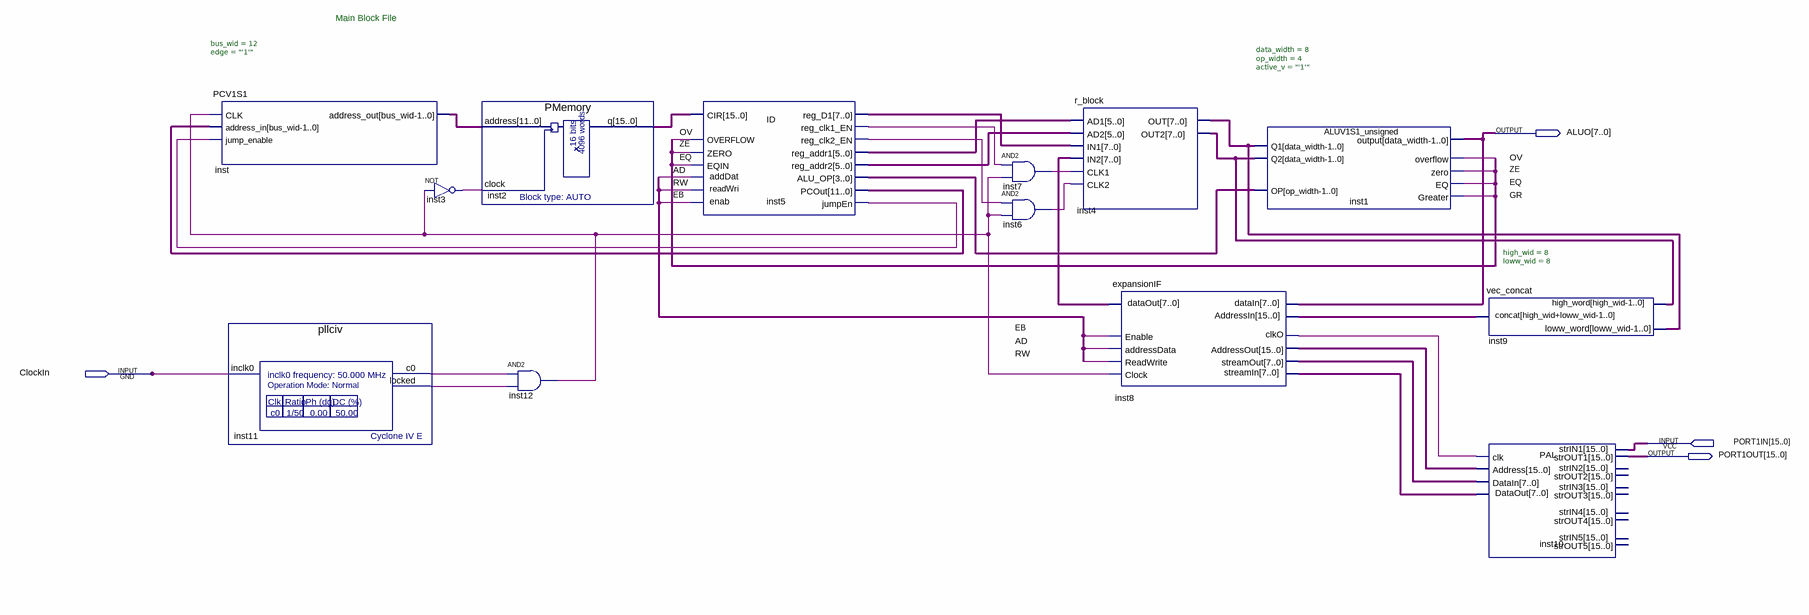
[diagram p0: schematic sheet]
// Quartus schematic SANDBOX.bdf as structural Verilog: 13 symbols, 4 pins
module SANDBOX (
  input  ClockIn,
  input  [15:0] PORT1IN,
  output [7:0] ALUO,
  output [15:0] PORT1OUT
);

  wire AD, EB, EQ, GR, inst3_out, inst5_jumpen, inst5_reg_clk1_en, inst5_reg_clk2_en, inst6_out, inst7_out,
       inst8_clko, inst11_c0, inst11_locked, inst12_out, OV, RW, ZE;
  wire [3:0] inst5_alu_op;
  wire [5:0] inst5_reg_addr1, inst5_reg_addr2;
  wire [7:0] inst4_out, inst4_out2, inst5_reg_d1, inst8_dataout, inst8_streamout, inst10_dataout;
  wire [11:0] inst5_pcout, inst_address_out;
  wire [15:0] inst2_q, inst8_addressout, inst9_concat;

  PCV1S1 #(.bus_wid(12), .\edge ("'1'")) inst (
    .CLK(inst12_out), .address_in(inst5_pcout), .jump_enable(inst5_jumpen), .address_out(inst_address_out));
  pllciv inst11 (.inclk0(ClockIn), .c0(inst11_c0), .locked(inst11_locked));
  not inst3 (inst3_out, inst12_out);
  PMemory inst2 (.address(inst_address_out), .clock(inst3_out), .q(inst2_q));
  and inst12 (inst12_out, inst11_c0, inst11_locked);
  ID inst5 (
    .CIR(inst2_q), .OVERFLOW(OV), .ZERO(ZE), .EQIN(EQ), .reg_D1(inst5_reg_d1),
    .reg_clk1_EN(inst5_reg_clk1_en), .reg_clk2_EN(inst5_reg_clk2_en), .reg_addr1(inst5_reg_addr1),
    .reg_addr2(inst5_reg_addr2), .ALU_OP(inst5_alu_op), .PCOut(inst5_pcout), .addDat(AD), .readWri(RW),
    .enab(EB), .jumpEn(inst5_jumpen));
  and inst7 (inst7_out, inst5_reg_clk1_en, inst12_out);
  and inst6 (inst6_out, inst5_reg_clk2_en, inst12_out);
  r_block inst4 (
    .AD1(inst5_reg_addr1), .AD2(inst5_reg_addr2), .IN1(inst5_reg_d1), .IN2(inst8_dataout), .CLK1(inst7_out),
    .CLK2(inst6_out), .OUT(inst4_out), .OUT2(inst4_out2));
  expansionIF inst8 (
    .Enable(EB), .addressData(AD), .ReadWrite(RW), .Clock(inst12_out), .dataIn(ALUO),
    .AddressIn(inst9_concat), .streamIn(inst10_dataout), .dataOut(inst8_dataout),
    .streamOut(inst8_streamout), .AddressOut(inst8_addressout), .clkO(inst8_clko));
  ALUV1S1_unsigned #(.data_width(8), .op_width(4), .active_v("'1'")) inst1 (
    .Q1(inst4_out), .Q2(inst4_out2), .OP(inst5_alu_op), .\output (ALUO), .overflow(OV), .zero(ZE), .EQ(EQ),
    .Greater(GR));
  vec_concat #(.high_wid(8), .loww_wid(8)) inst9 (.high_word(inst4_out2), .loww_word(inst4_out), .concat(inst9_concat));
  PAL inst10 (
    .clk(inst8_clko), .Address(inst8_addressout), .DataIn(inst8_streamout), .strIN1(PORT1IN),
    .DataOut(inst10_dataout), .strOUT1(PORT1OUT));  // open: strIN2, strIN3, strIN4, strIN5, strOUT2, strOUT3, strOUT4, strOUT5

  // Notes on the sheet:
  //   Main Block File
endmodule
